# EAGLE schematic roco1044 (EAGLE 9.5.2)
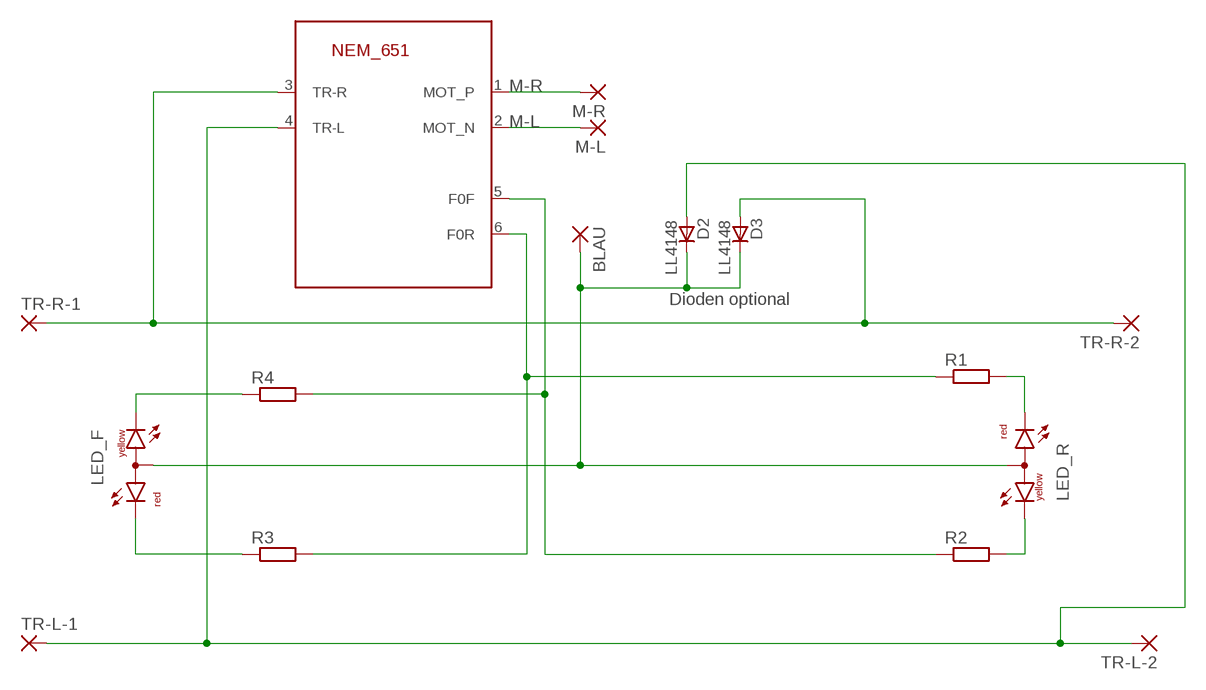
[diagram p0: schematic, sheet 1]

## Parts
651  NEM_651-TS  [53047-06]
BLAU  1,6/0,8  [1,6/0,8]
D2  LL4148  [SOD80_DO213AA_MINIMELF]
D3  LL4148  [SOD80_DO213AA_MINIMELF]
LED_F  DUOLED-RY-A  [DUOLED-A-5MM]
LED_R  DUOLED-RY-A  [DUOLED-A-5MM]
M-L  SMD5  [SMD2,54-5,08]
M-R  SMD5  [SMD2,54-5,08]
R1  R-EU_R1206  [R1206]
R2  R-EU_R1206  [R1206]
R3  R-EU_R1206  [R1206]
R4  R-EU_R1206  [R1206]
TR-L-1  SMD5  [SMD2,54-5,08]
TR-L-2  SMD5  [SMD2,54-5,08]
TR-R-1  SMD5  [SMD2,54-5,08]
TR-R-2  SMD5  [SMD2,54-5,08]

## Nets
M-L: 651.2(MOT_N) M-L.1(P)
M-R: 651.1(MOT_P) M-R.1(P)
N$1: BLAU.1(P) D2.C D3.C LED_F.A LED_R.A
N$2: 651.4(TR-L) D2.A TR-L-1.1(P) TR-L-2.1(P)
N$3: 651.3(TR-R) D3.A TR-R-1.1(P) TR-R-2.1(P)
N$5: 651.5(F0F) R2.1 R4.2
N$6: LED_R.CR R1.2
N$7: LED_R.CX(CY) R2.2
N$8: 651.6(F0R) R1.1 R3.2
N$9: LED_F.CR R3.1
N$10: LED_F.CX(CY) R4.1

## Notes on the sheet
- Dioden optional

## Library data of the parts
651 = con-nem:NEM_651: NEM651 Decoder Plug
BLAU = wirepad:1,6/0,8: THROUGH-HOLE PAD
D2 D3 = _hhn_diodes_smd:LL4148: 1N4148 General Purpose Rectifie SMD-Version of 1N4148 Case: SOD 80 = DO 213 AA = MINIMELF (Glass) Author: Dipl.-Ing. FH Rainer Bayer HHN Hochschule Heilbronn, rainer.bayer@hs-heilbronn.de Ingenieurbüro ing-rb, mail@ing-rb.de
LED_F LED_R = led:DUOLED-RY-A: DUO LED 2 colors (red/yellow), 5 mm, round, common Anode www.ligitek.com or other producers.
M-L M-R TR-L-1 TR-L-2 TR-R-1 TR-R-2 = wirepad:SMD5: SMD PAD
R1-R4 = rcl:R-EU_: RESISTOR, European symbol; SPICEPREFIX: R